# EAGLE design SensorBoard_Rev2 (EAGLE 4.16)
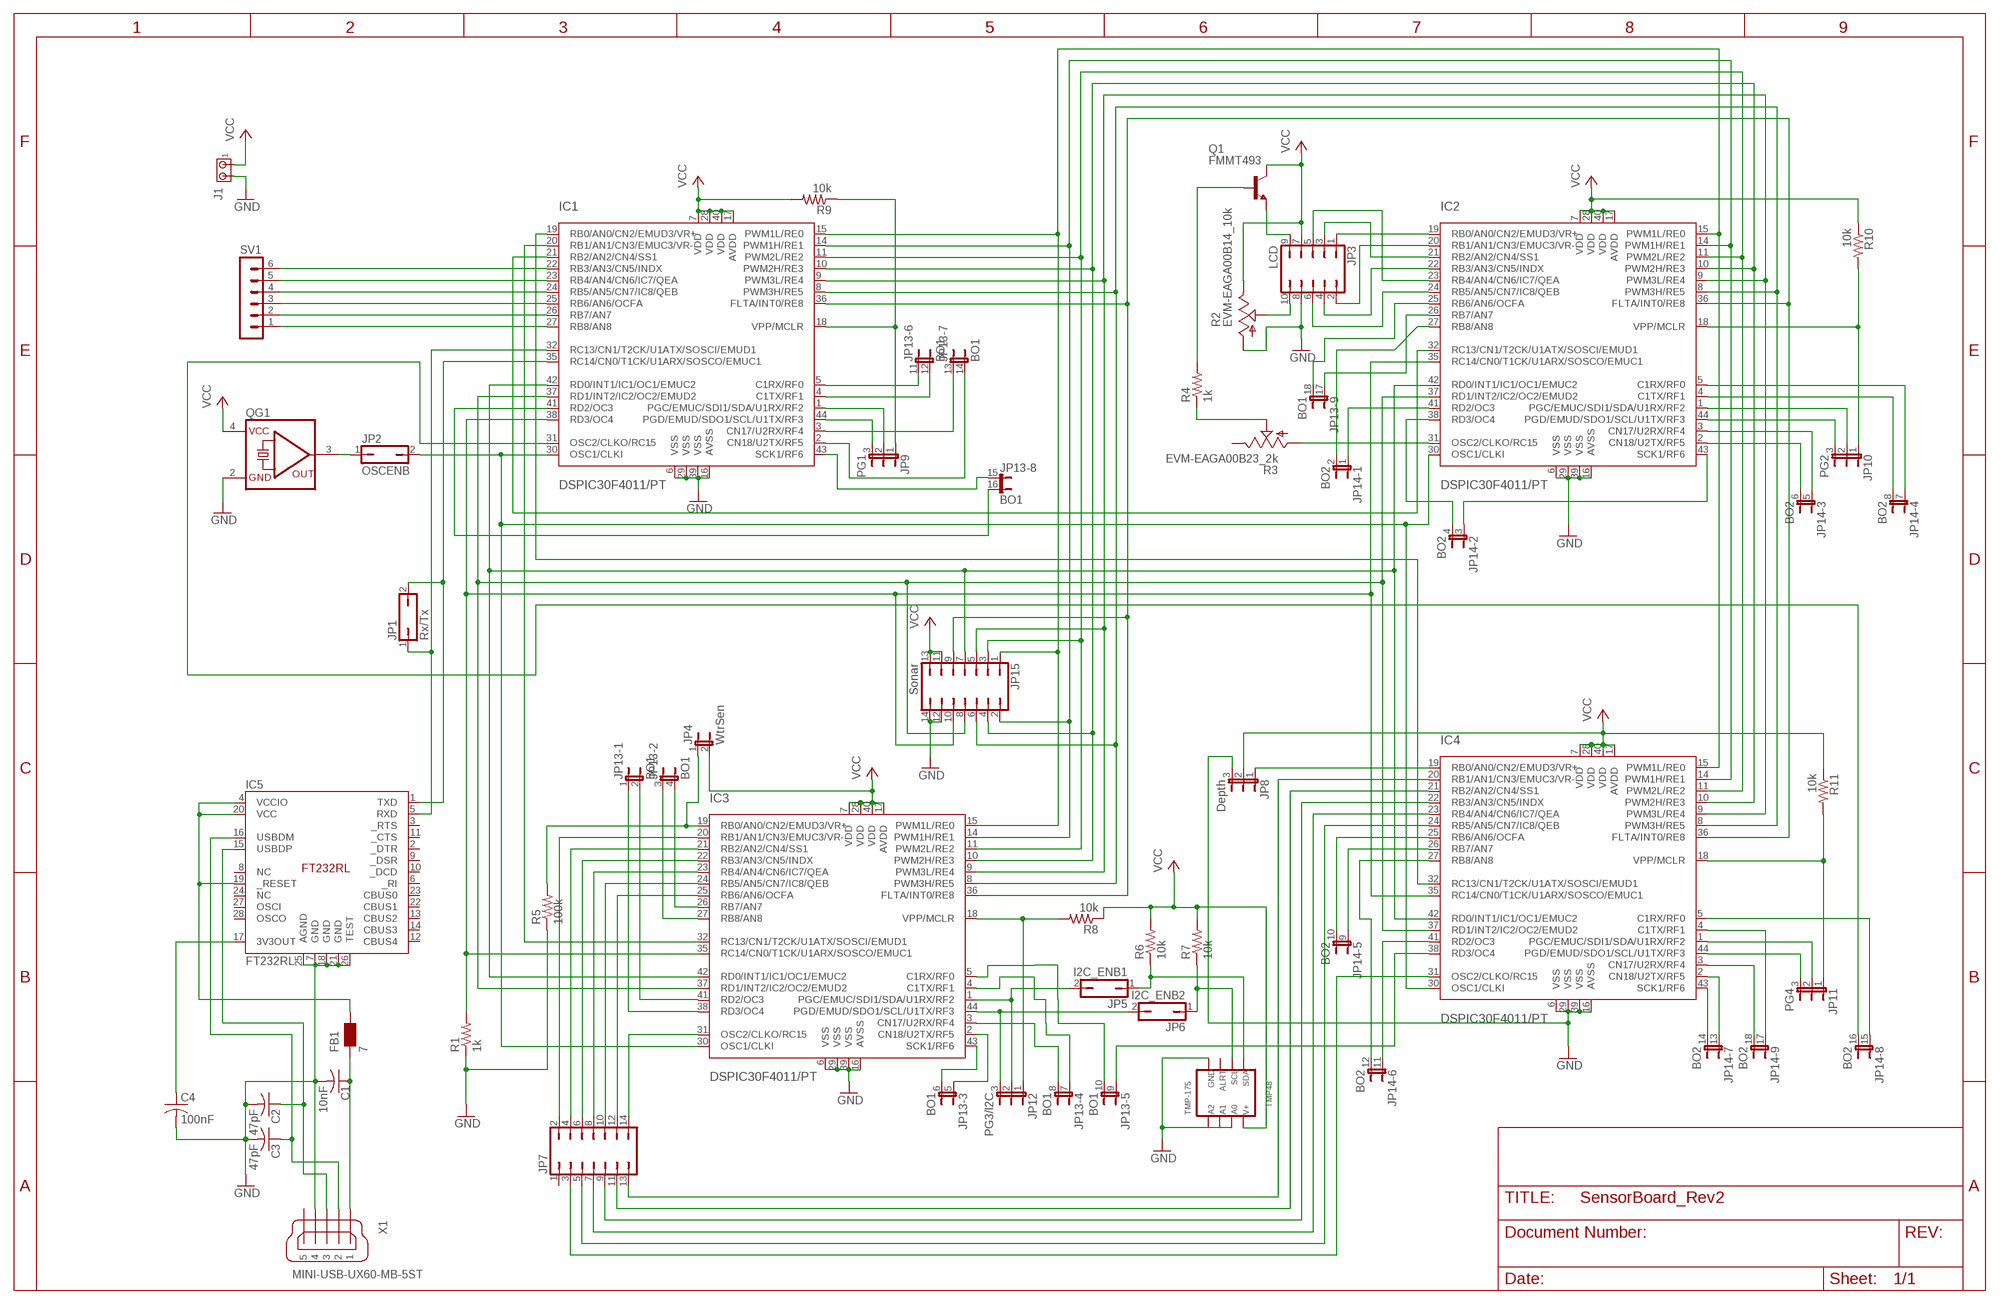
[diagram p0: schematic, sheet 1]

## Parts
C1  10nF  C-USC1206K  [C1206K]
C2  47pF  C-USC1206K  [C1206K]
C3  47pF  C-USC1206K  [C1206K]
C4  100nF  C-USC1206K  [C1206K]
FB1  7  WE-CBF_0805  [0805]
IC1  DSPIC30F4011/PT  [TQFP44]
IC2  DSPIC30F4011/PT  [TQFP44]
IC3  DSPIC30F4011/PT  [TQFP44]
IC4  DSPIC30F4011/PT  [TQFP44]
IC5  FT232RL  [SSOP-28]
J1  MTA02-156  [1X2MTA]
JP1  Rx/Tx  JP1Q  [JP1]
JP2  OSCENB  JP1Q  [JP1]
JP3  LCD  JP5Q  [JP5Q]
JP4  WtrSen  JP1E  [JP1]
JP5  I2C_ENB1  JP1Q  [JP1]
JP6  I2C_ENB2  JP1Q  [JP1]
JP7  JP7Q  [JP7Q]
JP8  Depth  JP2E  [JP2]
JP9  PG1  JP2E  [JP2]
JP10  PG2  JP2E  [JP2]
JP11  PG4  JP2E  [JP2]
JP12  PG3/I2C  JP2E  [JP2]
JP13  BO1  JP9QE  [JP9Q]
JP14  BO2  JP9QE  [JP9Q]
JP15  Sonar  JP7Q  [JP7Q]
Q1  FMMT493  -NPN-SOT23-EBC  [SOT23-EBC]
QG1  SG531  [DIL08-4]
R1  1k  R-US_R1206  [R1206]
R2  EVM-EAGA00B14_10k  TRIM_US-CT6  [CT6]
R3  EVM-EAGA00B23_2k  TRIM_US-CT6  [CT6]
R4  1k  R-US_R1206  [R1206]
R5  100k  R-US_R1206  [R1206]
R6  10k  R-US_R1206  [R1206]
R7  10k  R-US_R1206  [R1206]
R8  10k  R-US_R1206  [R1206]
R9  10k  R-US_R1206  [R1206]
R10  10k  R-US_R1206  [R1206]
R11  10k  R-US_R1206  [R1206]
SV1  MA06-1  [MA06-1]
TMP48  TMP-175  [SO-08]
X1  MINI-USB-UX60-MB-5ST  [UX60-MB-5ST]

## Nets
GND [4amps]: C1.2 C2.2 C3.2 C4.2 IC1.6(VSS) IC1.16(AVSS) IC1.29(VSS) IC1.39(VSS) IC2.6(VSS) IC2.16(AVSS) IC2.29(VSS) IC2.39(VSS) IC3.6(VSS) IC3.16(AVSS) IC3.29(VSS) IC3.39(VSS) IC4.6(VSS) IC4.16(AVSS) IC4.29(VSS) IC4.39(VSS) IC5.7(GND) IC5.18(GND) IC5.21(GND) IC5.25(AGND) IC5.26(TEST) J1.2 JP3.8 JP8.3 JP15.12 JP15.14 QG1.2(GND) R1.1 R2.A R5.1 TMP48.4 TMP48.5 TMP48.6 TMP48.7 X1.4
N$1: IC1.19(RB0/AN0/CN2/EMUD3/VR+) IC4.32(RC13/CN1/T2CK/U1ATX/SOSCI/EMUD1)
N$2: IC1.20(RB1/AN1/CN3/EMUC3/VR-) IC3.32(RC13/CN1/T2CK/U1ATX/SOSCI/EMUD1)
N$3: IC1.21(RB2/AN2/CN4/SS1) IC2.32(RC13/CN1/T2CK/U1ATX/SOSCI/EMUD1)
N$4: IC1.22(RB3/AN3/CN5/INDX) SV1.6
N$5: IC1.24(RB5/AN5/CN7/IC8/QEB) SV1.4
N$6: IC1.25(RB6/AN6/OCFA) SV1.3
N$7: IC1.26(RB7/AN7) SV1.2
N$8: IC1.27(RB8/AN8) SV1.1
N$9: IC1.30(OSC1/CLKI) IC2.30(OSC1/CLKI) IC3.30(OSC1/CLKI) IC4.30(OSC1/CLKI) JP2.2
N$10: C2.1 IC5.15(USBDP) X1.3
N$11: C1.1 FB1.1 X1.1
N$12: C3.1 IC5.16(USBDM) X1.2
N$13: C4.1 IC5.17(3V3OUT)
N$14: FB1.2 IC5.4(VCCIO) IC5.19(_RESET) IC5.20(VCC)
N$15: IC1.32(RC13/CN1/T2CK/U1ATX/SOSCI/EMUD1) IC5.5(RXD) JP1.1
N$16: IC1.35(RC14/CN0/T1CK/U1ARX/SOSCO/EMUC1) IC5.1(TXD) JP1.2
N$17: JP2.1 QG1.3(OUT)
N$18: IC1.23(RB4/AN4/CN6/IC7/QEA) SV1.5
N$19: IC1.15(PWM1L/RE0) IC2.15(PWM1L/RE0) IC3.15(PWM1L/RE0) IC4.15(PWM1L/RE0) JP15.1
N$20: IC1.14(PWM1H/RE1) IC2.14(PWM1H/RE1) IC3.14(PWM1H/RE1) IC4.14(PWM1H/RE1) JP15.2
N$21: IC1.11(PWM2L/RE2) IC2.11(PWM2L/RE2) IC3.11(PWM2L/RE2) IC4.11(PWM2L/RE2) JP15.3
N$22: IC1.10(PWM2H/RE3) IC2.10(PWM2H/RE3) IC3.10(PWM2H/RE3) IC4.10(PWM2H/RE3) JP15.4
N$23: IC1.9(PWM3L/RE4) IC2.9(PWM3L/RE4) IC3.9(PWM3L/RE4) IC4.9(PWM3L/RE4) JP15.5
N$24: IC1.8(PWM3H/RE5) IC2.8(PWM3H/RE5) IC3.8(PWM3H/RE5) IC4.8(PWM3H/RE5) JP15.6
N$25: IC1.42(RD0/INT1/IC1/OC1/EMUC2) IC2.42(RD0/INT1/IC1/OC1/EMUC2) IC3.42(RD0/INT1/IC1/OC1/EMUC2) IC4.42(RD0/INT1/IC1/OC1/EMUC2) JP15.7
N$26: IC1.37(RD1/INT2/IC2/OC2/EMUD2) IC2.37(RD1/INT2/IC2/OC2/EMUD2) IC3.37(RD1/INT2/IC2/OC2/EMUD2) IC4.37(RD1/INT2/IC2/OC2/EMUD2) JP15.8
N$27: IC1.38(RD3/OC4) IC2.35(RC14/CN0/T1CK/U1ARX/SOSCO/EMUC1) IC3.35(RC14/CN0/T1CK/U1ARX/SOSCO/EMUC1) IC4.35(RC14/CN0/T1CK/U1ARX/SOSCO/EMUC1) JP15.10 R1.2
N$28: IC1.36(FLTA/INT0/RE8) IC2.36(FLTA/INT0/RE8) IC3.36(FLTA/INT0/RE8) IC4.36(FLTA/INT0/RE8) JP15.9
N$29: IC2.19(RB0/AN0/CN2/EMUD3/VR+) JP3.1
N$30: IC2.20(RB1/AN1/CN3/EMUC3/VR-) JP3.2
N$31: IC2.21(RB2/AN2/CN4/SS1) JP3.3
N$32: IC2.22(RB3/AN3/CN5/INDX) JP3.4
N$33: IC2.23(RB4/AN4/CN6/IC7/QEA) JP3.5
N$34: IC2.24(RB5/AN5/CN7/IC8/QEB) JP3.6
N$35: JP3.10 R2.S
N$36: IC2.31(OSC2/CLKO/RC15) R3.A
N$37: R3.S R4.1
N$38: JP3.9 Q1.E
N$39: Q1.B R4.2
N$40: IC3.21(RB2/AN2/CN4/SS1) JP7.4
N$41: IC3.19(RB0/AN0/CN2/EMUD3/VR+) JP4.1 R5.2
N$42: IC3.22(RB3/AN3/CN5/INDX) JP7.6
N$43: JP6.1 R7.1 TMP48.2
N$44: JP5.1 R6.1 TMP48.1
N$45: IC3.1(PGC/EMUC/SDI1/SDA/U1RX/RF2) JP5.2 JP12.2
N$46: IC3.44(PGD/EMUD/SDO1/SCL/U1TX/RF3) JP6.2 JP12.3
N$47: IC3.23(RB4/AN4/CN6/IC7/QEA) JP7.8
N$48: IC3.24(RB5/AN5/CN7/IC8/QEB) JP7.10
N$49: IC3.25(RB6/AN6/OCFA) JP7.12
N$50: IC3.20(RB1/AN1/CN3/EMUC3/VR-) JP7.2
N$51: IC3.31(OSC2/CLKO/RC15) JP7.14
N$52: IC4.19(RB0/AN0/CN2/EMUD3/VR+) JP8.1
N$53: IC4.20(RB1/AN1/CN3/EMUC3/VR-) JP7.13
N$54: IC4.21(RB2/AN2/CN4/SS1) JP7.11
N$55: IC4.22(RB3/AN3/CN5/INDX) JP7.9
N$56: IC4.23(RB4/AN4/CN6/IC7/QEA) JP7.7
N$57: IC4.24(RB5/AN5/CN7/IC8/QEB) JP7.5
N$58: IC4.31(OSC2/CLKO/RC15) JP7.3
N$59: IC3.18(VPP/MCLR) JP12.1 R8.2
N$60: IC1.18(VPP/MCLR) JP9.1 R9.1
N$61: IC2.18(VPP/MCLR) JP10.1 R10.2
N$62: IC1.1(PGC/EMUC/SDI1/SDA/U1RX/RF2) JP9.2
N$63: IC1.44(PGD/EMUD/SDO1/SCL/U1TX/RF3) JP9.3
N$64: IC2.1(PGC/EMUC/SDI1/SDA/U1RX/RF2) JP10.2
N$65: IC2.44(PGD/EMUD/SDO1/SCL/U1TX/RF3) JP10.3
N$66: IC4.18(VPP/MCLR) JP11.1 R11.2
N$67: IC4.1(PGC/EMUC/SDI1/SDA/U1RX/RF2) JP11.2
N$68: IC4.44(PGD/EMUD/SDO1/SCL/U1TX/RF3) JP11.3
N$69: IC3.38(RD3/OC4) JP13.1
N$70: IC3.41(RD2/OC3) JP13.2
N$71: IC3.27(RB8/AN8) JP13.3
N$72: IC3.26(RB7/AN7) JP13.4
N$73: IC3.2(CN18/U2TX/RF5) JP13.5
N$74: IC3.43(SCK1/RF6) JP13.6
N$75: IC3.4(C1TX/RF1) JP13.7
N$76: IC3.3(CN17/U2RX/RF4) JP13.8
N$77: IC3.5(C1RX/RF0) JP13.10
N$78: IC1.43(SCK1/RF6) JP13.15
N$79: IC1.2(CN18/U2TX/RF5) JP13.14
N$80: IC1.3(CN17/U2RX/RF4) JP13.13
N$81: IC1.4(C1TX/RF1) JP13.12
N$82: IC1.5(C1RX/RF0) JP13.11
N$83: IC1.41(RD2/OC3) JP13.16
N$84: IC2.25(RB6/AN6/OCFA) JP13.18
N$85: IC2.26(RB7/AN7) JP13.17
N$86: IC2.27(RB8/AN8) JP14.2
N$87: IC2.41(RD2/OC3) JP14.1
N$88: IC2.38(RD3/OC4) JP14.4
N$89: IC2.43(SCK1/RF6) JP14.3
N$90: IC2.2(CN18/U2TX/RF5) JP14.6
N$91: IC2.3(CN17/U2RX/RF4) JP14.5
N$92: IC2.5(C1RX/RF0) JP14.7
N$93: IC2.4(C1TX/RF1) JP14.8
N$94: IC4.25(RB6/AN6/OCFA) JP14.10
N$95: IC4.26(RB7/AN7) JP14.9
N$96: IC4.27(RB8/AN8) JP14.12
N$97: IC4.41(RD2/OC3) JP14.11
N$98: IC4.43(SCK1/RF6) JP14.14
N$99: IC4.2(CN18/U2TX/RF5) JP14.13
N$100: IC4.3(CN17/U2RX/RF4) JP14.18
N$101: IC4.4(C1TX/RF1) JP14.17
N$102: IC4.5(C1RX/RF0) JP14.15
N$103: IC4.38(RD3/OC4) JP13.9
N$104: IC1.31(OSC2/CLKO/RC15) JP14.16
VCC [4amps]: IC1.7(VDD) IC1.17(AVDD) IC1.28(VDD) IC1.40(VDD) IC2.7(VDD) IC2.17(AVDD) IC2.28(VDD) IC2.40(VDD) IC3.7(VDD) IC3.17(AVDD) IC3.28(VDD) IC3.40(VDD) IC4.7(VDD) IC4.17(AVDD) IC4.28(VDD) IC4.40(VDD) J1.1 JP3.7 JP4.2 JP8.2 JP15.11 JP15.13 Q1.C QG1.4(VCC) R2.E R6.2 R7.2 R8.1 R9.2 R10.1 R11.1 TMP48.8
Unconnected: IC5.2(_DTR) IC5.3(_RTS) IC5.6(_RI) IC5.8(NC) IC5.9(_DSR) IC5.10(_DCD) IC5.11(_CTS) IC5.12(CBUS4) IC5.13(CBUS2) IC5.14(CBUS3) IC5.22(CBUS1) IC5.23(CBUS0) IC5.24(NC) IC5.27(OSCI) IC5.28(OSCO) JP7.1 R3.E TMP48.3 X1.5

## Library data of the parts
C1-C4 = rcl:C-US: CAPACITOR, American symbol
FB1 = wuerth-elektronik:WE-CBF: SMD EMI Suppression Ferrite Beads - excellent anti-EMI properties - low DCR - impedances till 3000 ohms - rated current up to 6 A
IC1-IC4 = microchip-dspic:DSPIC30F4011: dsPIC Motion Controller DSC
IC5 = ftdi4:FT232RL
J1 = con-amp:MTA02-156: AMP connector
JP1 JP2 JP5 JP6 = jumper:JP1Q: JUMPER
JP3 = jumper:JP5Q: JUMPER
JP4 = jumper:JP1E: JUMPER
JP7 JP15 = jumper:JP7Q: JUMPER
JP8-JP12 = jumper:JP2E: JUMPER
JP13 JP14 = jumper:JP9QE: JUMPER
Q1 = transistor:*-NPN-: NPN Transistror
QG1 = crystal:SG531: CRYSTAL RESONATOR
R1 R4-R11 = rcl:R-US_: RESISTOR, American symbol
R2 R3 = pot:TRIM_US-: POTENTIOMETER
SV1 = con-lstb:MA06-1: PIN HEADER
TMP48 = texas:TMP-175
X1 = con-hirose:MINI-USB-: MINI USB Connector Source: http://www.hirose.co.jp/cataloge_hp/e24000019.pdf

## Net classes
0 default: width 0.178 mm
1 2amps: width 0.178 mm
2 4amps: width 0.533 mm

## Board
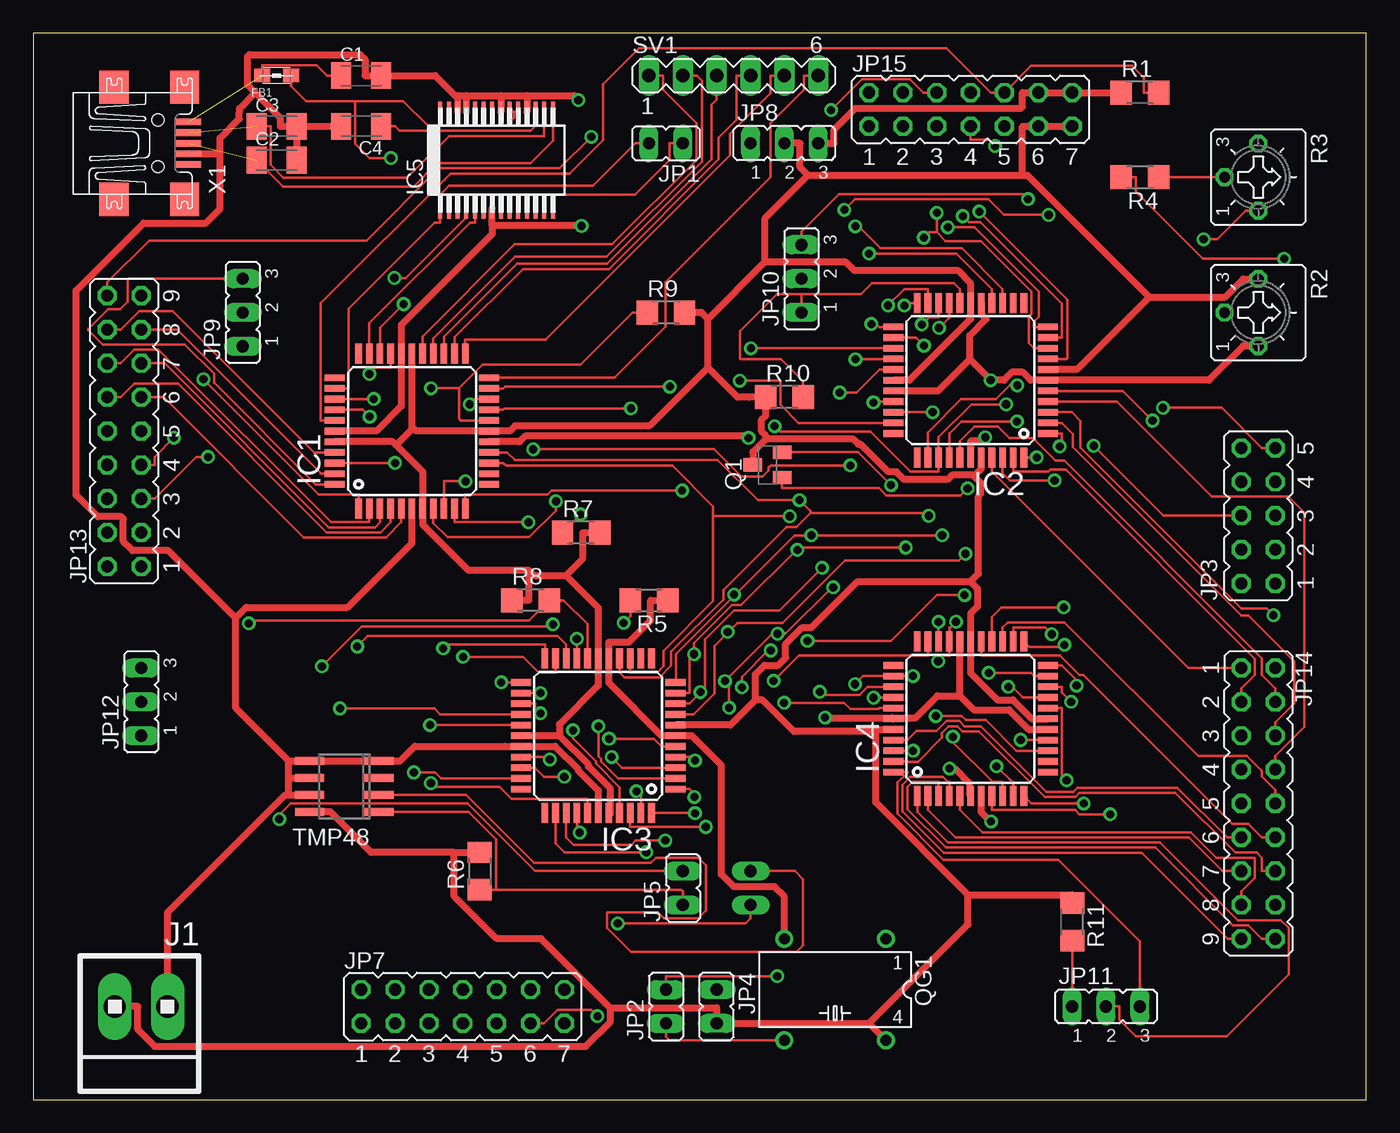
[diagram p1: board, top side]
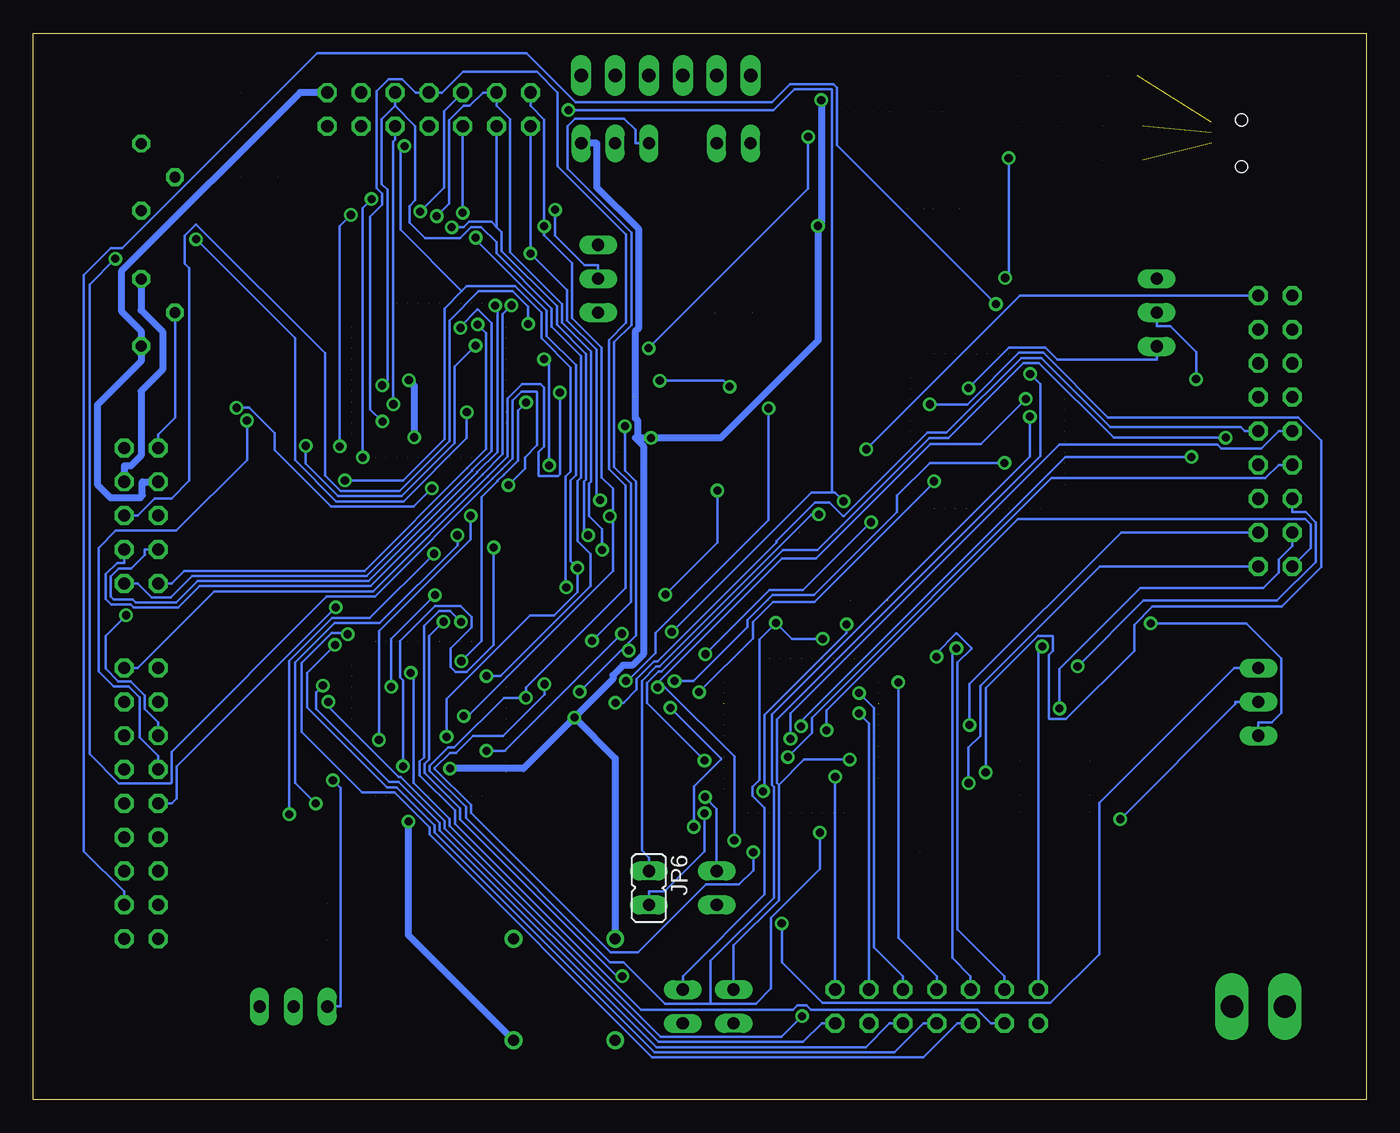
[diagram p2: board, bottom side, seen from below]

Size 100 x 80 mm. Coordinates in mm from the lower left corner, seen from the top.
Outline: 0,0 100,0 100,80 0,80 0,0
Copper layers (1*16): Top 0.035mm / dielectric 1.5mm / Bottom 0.035mm
Design rules "default": minimum track width 10mil, minimum drill 24mil, track to track 8mil, track to pad 8mil, pad to pad 8mil, via to via 8mil, smd to smd 8mil, copper to edge 40mil, drill to drill 8mil, minimum pad ring 10mil, minimum via ring 8mil, stop-mask expansion 4mil, vias tented up to drill 0mil, thermal gap 10mil

### Footprints (pad centres in the part's own frame; a part is rotated, then mirrored left to right if it is on the bottom)
C1206K = smd 1.5 x 2: 1 -1.5,0; 2 1.5,0
0805 = smd 1.2 x 1: 1 -1.1,0; 2 1.1,0
TQFP44 = smd 1.5 x 0.5: 1 -5.8,4; 2 -5.8,3.2; 3 -5.8,2.4; 4 -5.8,1.6; 5 -5.8,0.8; 6 -5.8,0; 7 -5.8,-0.8; 8 -5.8,-1.6; 9 -5.8,-2.4; 10 -5.8,-3.2; 11 -5.8,-4; 23 5.8,-4; 24 5.8,-3.2; 25 5.8,-2.4; 26 5.8,-1.6; 27 5.8,-0.8; 28 5.8,0; 29 5.8,0.8; 30 5.8,1.6; 31 5.8,2.4; 32 5.8,3.2; 33 5.8,4 | smd 0.5 x 1.5: 12 -4,-5.8; 13 -3.2,-5.8; 14 -2.4,-5.8; 15 -1.6,-5.8; 16 -0.8,-5.8; 17 0,-5.8; 18 0.8,-5.8; 19 1.6,-5.8; 20 2.4,-5.8; 21 3.2,-5.8; 22 4,-5.8; 34 4,5.8; 35 3.2,5.8; 36 2.4,5.8; 37 1.6,5.8; 38 0.8,5.8; 39 0,5.8; 40 -0.8,5.8; 41 -1.6,5.8; 42 -2.4,5.8; 43 -3.2,5.8; 44 -4,5.8
SSOP-28 = smd 0.3 x 1.5: 1 -4.225,-3.625; 2 -3.575,-3.625; 3 -2.925,-3.625; 4 -2.275,-3.625; 5 -1.625,-3.625; 6 -0.975,-3.625; 7 -0.325,-3.625; 8 0.325,-3.625; 9 0.975,-3.625; 10 1.625,-3.625; 11 2.275,-3.625; 12 2.925,-3.625; 13 3.575,-3.625; 14 4.225,-3.625; 15 4.225,3.625; 16 3.575,3.625; 17 2.925,3.625; 18 2.275,3.625; 19 1.625,3.625; 20 0.975,3.625; 21 0.325,3.625; 22 -0.325,3.625; 23 -0.975,3.625; 24 -1.625,3.625; 25 -2.275,3.625; 26 -2.925,3.625; 27 -3.575,3.625; 28 -4.225,3.625
1X2MTA = drill 1.676 long: 1 1.981,0; 2 -1.981,0
JP1 = drill 0.914 long: 1 0,-1.27; 2 0,1.27
JP5Q = drill 0.914 octagon: 1 -5.08,-1.27; 2 -5.08,1.27; 3 -2.54,-1.27; 4 -2.54,1.27; 5 0,-1.27; 6 0,1.27; 7 2.54,-1.27; 8 2.54,1.27; 9 5.08,-1.27; 10 5.08,1.27
JP7Q = drill 0.914 octagon: 1 -7.62,-1.27; 2 -7.62,1.27; 3 -5.08,-1.27; 4 -5.08,1.27; 5 -2.54,-1.27; 6 -2.54,1.27; 7 0,-1.27; 8 0,1.27; 9 2.54,-1.27; 10 2.54,1.27; 11 5.08,-1.27; 12 5.08,1.27; 13 7.62,-1.27; 14 7.62,1.27
JP2 = drill 0.914 long: 1 -2.54,0; 2 0,0; 3 2.54,0
JP9Q = drill 0.914 octagon: 1 -10.16,-1.27; 2 -10.16,1.27; 3 -7.62,-1.27; 4 -7.62,1.27; 5 -5.08,-1.27; 6 -5.08,1.27; 7 -2.54,-1.27; 8 -2.54,1.27; 9 0,-1.27; 10 0,1.27; 11 2.54,-1.27; 12 2.54,1.27; 13 5.08,-1.27; 14 5.08,1.27; 15 7.62,-1.27; 16 7.62,1.27; 17 10.16,-1.27; 18 10.16,1.27
SOT23-EBC = smd 1 x 1.4: B 0.95,-1.1; C 0,1.1; E -0.95,-1.1
DIL08-4 = drill 0.813 round: 1 -3.81,-3.81; 2 3.81,-3.81; 3 3.81,3.81; 4 -3.81,3.81
R1206 = smd 1.6 x 1.8: 1 -1.4,0; 2 1.4,0
CT6 = drill 0.813 octagon: A 2.515,0; E -2.515,0; S 0,-2.54
MA06-1 = drill 1.016 long: 1 -6.35,0; 2 -3.81,0; 3 -1.27,0; 4 1.27,0; 5 3.81,0; 6 6.35,0
SO-08 = smd 0.6 x 2.2: 1 -1.905,-2.6; 2 -0.635,-2.6; 3 0.635,-2.6; 4 1.905,-2.6; 5 1.905,2.6; 6 0.635,2.6; 7 -0.635,2.6; 8 -1.905,2.6
UX60-MB-5ST = smd 2 x 0.5: 1 2.25,1.6; 2 2.25,0.8; 3 2.25,0; 4 2.25,-0.8; 5 2.25,-1.6 | smd 2.2 x 2.5: M1 -3.3,-4.2; M2 -3.3,4.2; M3 2,4.2; M4 2,-4.2 | hole 0.9: 0,-1.75; 0,1.75

### Placement (x,y rotation side)
C1  24.6,76.83 0 top
C2  18.25,70.48 0 top
C3  18.25,73.02 0 top
C4  24.6,73.02 180 top
FB1  18.25,76.83 0 top
IC1  28.41,50.16 90 top
IC2  70.32,53.97 180 top
IC3  42.38,27.3 180 top
IC4  70.32,28.57 90 top
IC5  34.76,70.48 0 top
J1  8.09,6.98 180 top
JP1  47.46,71.75 90 top
JP2  47.46,6.98 0 top
JP3  91.91,43.81 90 top
JP4  51.27,6.98 180 top
JP5  48.73,15.87 0 top
JP6  53.81,15.87 180 bottom
JP7  32.22,6.98 0 top
JP8  56.35,71.75 0 top
JP9  15.71,59.05 90 top
JP10  57.62,61.59 90 top
JP11  80.48,6.98 0 top
JP12  8.09,29.84 90 top
JP13  6.82,50.16 90 top
JP14  91.91,22.22 270 top
JP15  70.32,74.29 0 top
Q1  55.08,47.62 90 top
QG1  60.16,8.25 180 top
R1  83.02,75.56 0 top
R2  91.91,59.05 270 top
R3  91.91,69.21 270 top
R4  83.02,69.21 180 top
R5  46.19,37.46 180 top
R6  33.49,17.14 90 top
R7  41.11,42.54 0 top
R8  37.3,37.46 0 top
R9  47.46,59.05 0 top
R10  56.35,52.7 0 top
R11  77.94,13.33 270 top
SV1  52.54,76.83 0 top
TMP48  23.33,23.49 90 top
X1  9.36,71.75 0 top

### Tracks (layer width: path | path; a pad name or v marks a point on that pad's centre or on a via)
GND  (via drill 0.61 pad 1.02)  (30 unrouted)
  Top 0.498: 70.22,23.74 70.22,22.87 IC4.6 | 64.44,28.65 64.44,28.57 | 71.47,58.54 71.47,58.56 71.16,58.87
  Top 0.533: 15.18,36.13 10.13,41.19 7.44,41.19 6.75,41.88 6.75,43.57 6.6,43.73 4.84,43.73 3.22,45.35 3.22,60.7 8.28,65.77 12.93,65.77 14,66.83 14,70.96 | 14,70.96 14,72.14 15.45,73.59 15.45,74.1 15.47,74.11 15.47,74.35 16.66,75.55 | 16.66,75.55 18.53,73.68 18.53,73.02 C3.2 | 16.66,75.55 16.07,76.13 16.07,78.25 16.23,78.41 24.53,78.41 24.88,78.05 24.88,76.83 C1.2 30.14,76.83 31.83,75.14 | 15.18,36.13 15.18,29.37 19.16,25.39 | IC1.6 28.41,41.76 23.58,36.92 15.97,36.92 15.18,36.13 | IC3.39 42.38,23.2 40.9,24.67 40.9,24.75 39.15,26.5 IC3.29 35.36,26.5 28.61,26.5 27.5,25.39 TMP48.4 TMP48.5 19.16,25.39 | 69.52,30.28 67.83,30.28 66.19,28.65 64.44,28.65 59.42,28.65 v59.4,28.66 | QG1.2 56.35,15.23 55.62,15.96 52.55,15.96 51.63,16.88 51.63,25.07 49.4,27.3 IC3.6 47.14,27.3 43.18,31.26 IC3.16 43.18,34.32 44.68,34.32 46.32,35.96 46.32,37.46 R5.1 | 69.52,30.28 70.56,29.25 73.19,29.25 74.67,27.77 IC4.16 | v71.42,49.69 71.13,49.39 70.32,49.39 IC2.39 | 37.04,75.33 40.55,75.33 v40.88,74.99 | 70.22,23.74 69.13,24.83 v68.74,24.83 | 69.52,30.28 IC4.29 | v53.66,49.64 53.53,49.77 36.91,49.77 36.49,49.36 IC1.16 | 34.44,65.55 34.44,64.95 27.61,58.12 IC1.29 27.61,52.03 25.74,50.16 23.83,50.16 IC1.39 | 35.09,75.33 37.04,75.33 | v41.13,65.55 34.44,65.55 | 34.44,65.55 34.44,65.63 IC5.7 | 70.25,55.55 67.88,53.17 IC2.29 | 70.25,55.55 v71.83,53.97 72.82,53.97 73.42,54.57 74.23,54.57 74.83,53.97 IC2.6 88.21,53.97 90.78,56.54 R2.A | 19.16,22.86 18.88,22.86 10.07,14.04 J1.2 | 70.25,55.55 70.25,57.33 71.47,58.54 | C3.2 C2.2 | C3.2 C4.2 | IC2.16 71.16,59.73 71.16,58.87 | 19.16,22.86 19.16,24.12 | 19.16,24.12 19.16,25.39
  Top 0.533: 31.83,75.14 31.83,75.33 32.48,75.33 | 31.83,75.14 IC5.26 | 37.04,75.33 IC5.18 | 35.09,75.33 35.09,75.14 IC5.21 | 32.48,75.33 35.09,75.33 | 32.48,75.33 32.48,75.14 IC5.25 | JP8.3 60.07,71.75 60.07,72.78 61.67,74.38 74.06,74.38 74.22,74.53 74.22,75.56 JP15.12 JP15.14 R1.1 | 19.16,22.86 TMP48.7 | 19.16,24.12 TMP48.6 | 14,70.96 13.98,70.96 13.98,70.95 X1.4 | 64.44,28.57 IC4.39 64.44,28.57
  Bottom 0.533: JP15.14 79.99,75.56 93.4,62.14 93.4,59.16 91.91,57.67 R2.A 91.91,55.4 95.2,52.11 95.2,46.15 94.22,45.17 91.98,45.17 91.82,45.32 91.82,46.35 JP3.8 | v59.4,28.66 56.52,31.55 56.52,31.83 55.77,32.58 55.06,32.58 54.22,33.41 54.22,49.04 54.82,49.64 | 54.82,49.64 54.63,49.83 54.63,50.93 54.82,51.12 54.82,57.64 54.57,57.89 54.57,65.29 57.71,68.42 57.71,71.75 JP8.3 | v59.4,28.66 63.23,24.83 v68.74,24.83 | v71.83,53.97 71.42,53.56 v71.42,49.69 | v40.88,74.99 40.88,65.8 v41.13,65.55 41.13,56.95 48.44,49.64 v53.66,49.64 54.82,49.64 | QG1.2 56.35,25.61 v59.4,28.66
N$1  (via drill 0.61 pad 1.02)  (2 unrouted)
  Top 0.178: v55.53,31.42 57.44,33.33 67.12,33.33 IC4.32 | IC1.19 35.25,51.76 35.35,51.86 v44.84,51.86
  Bottom 0.178: v55.53,31.42 55.42,31.42 53.32,33.52 53.32,35 44.84,43.48 v44.84,51.86
N$2  (via drill 0.61 pad 1.02)  (2 unrouted)
  Top 0.178: IC3.32 30.61,24.1 30.16,24.54 v28.55,24.54 | v32.73,52.16 33.13,52.56 IC1.20
  Bottom 0.178: v32.73,52.16 29.91,52.16 26.04,56.03 24.23,56.03 19.36,51.17 5.08,51.17 3.37,49.46 3.37,39.94 6.32,37 16.04,37 17.41,35.62 17.41,33.65 22.52,28.54 23.77,28.54 23.81,28.59 23.81,33.35 23.5,33.66 23.5,34.75 23.55,34.8 24.64,34.8 28.55,30.89 v28.55,24.54
N$3  (via drill 0.61 pad 1.02)  (2 unrouted)
  Top 0.178: v47.76,53.49 35.38,53.49 35.25,53.36 IC1.21 | v53,53.93 56.01,53.93 56.05,53.88 56.05,52.14 57.42,50.77 IC2.32
  Bottom 0.178: v53,53.93 48.2,53.93 v47.76,53.49
N$4  (1 unrouted)
  Top 0.178: IC1.22 43.62,54.16 47.44,57.98 47.44,61.34 55.32,69.21 55.32,73.26 57.83,75.77 57.83,76.83 SV1.6
N$5  (1 unrouted)
  Top 0.178: IC1.24 31.61,57.2 36.74,62.32 43.2,62.32 51.42,70.54 51.42,72.17 52.75,73.5 52.75,76.83 SV1.4
N$6  (1 unrouted)
  Top 0.178: SV1.3 51.27,75.01 50.9,74.64 50.9,70.56 43.04,62.71 36.28,62.71 30.81,57.24 IC1.25
N$7  (1 unrouted)
  Top 0.178: SV1.2 49.79,76.83 50.17,76.44 50.17,70.38 43.02,63.23 36.13,63.23 30.01,57.1 IC1.26
N$8  (1 unrouted)
  Top 0.178: SV1.1 47.25,76.83 47.25,75.77 49.75,73.27 49.75,70.49 43.42,64.17 36.12,64.17 29.21,57.26 IC1.27
N$9  (via drill 0.61 pad 1.02)  (4 unrouted)
  Top 0.178: v63.03,52.3 63.1,52.37 63.48,52.37 IC2.30 | v25.21,54.45 25.68,54.91 26.81,54.91 IC1.30 | v55.81,9.26 47.46,9.26 JP2.2 | v69.23,35.85 68.79,35.41 68.72,35.41 IC4.30 68.72,33.33 68.33,33.33 v67.89,32.89 | v38.74,25.52 38.56,25.7 37.62,25.7 IC3.30
  Bottom 0.178: 44.06,23.62 44.06,14.95 47.46,11.55 47.46,9.26 JP2.2 | v25.21,54.45 24.43,53.66 24.43,48.29 44.19,28.52 44.19,23.75 44.06,23.62 | v38.74,25.52 42.16,25.52 44.06,23.62 | v67.89,32.89 66.38,34.4 66.38,45.2 65.15,46.42 65.15,46.44 64.68,46.91 64.67,46.91 63.64,47.93 63.64,51.69 v63.03,52.3 | v55.81,9.26 56.22,9.26 67.99,21.02 67.99,21.84 70.64,24.5 70.64,25.2 70.3,25.54 70.3,34.78 v69.23,35.85
N$10  (3 unrouted)
  Top 0.178: IC5.15 38.98,71.94 37.3,70.25 30.26,70.25 28.51,68.5 18.72,68.5 C2.1
N$11  (3 unrouted)
  Top 0.178: C1.1 22.05,76.83 21.26,77.62 17.15,77.62 FB1.1
N$12  (3 unrouted)
  Top 0.178: C3.1 17.79,73.02 17.79,70.13 18.75,69.17 28.06,69.17 31.18,72.29 38.33,72.29 38.33,72.3 IC5.16
N$13  (2 unrouted)
  Top 0.178: C4.1 27.14,73.02 27.49,72.68 37.3,72.68 37.69,73.06 IC5.17
N$14  (via drill 0.61 pad 1.02)  (4 unrouted)
  Top 0.178: 24.14,74.92 20.46,74.92 19.35,76.03 FB1.2 | 24.14,74.92 27.76,74.92 29.63,73.06 35.45,73.06 36.06,73.67 36.06,74.1 | 24.14,74.92 24.14,71.72 25.23,70.64 v26.82,70.64 | v27.08,61.65 27.95,61.65 32.48,66.19 IC5.4 | 36.06,74.1 IC5.19 | 36.06,74.1 IC5.20
  Bottom 0.178: v26.82,70.64 26.82,61.91 v27.08,61.65
N$15  (2 unrouted)
  Top 0.178: IC1.32 25.21,58.24 32.78,65.81 33.13,65.81 IC5.5 33.13,67.9 45.14,67.9 47.72,70.48 47.72,71.75 JP1.1
N$16  (2 unrouted)
  Top 0.178: JP1.2 45.18,71.75 41.99,68.56 31.19,68.56 30.54,67.9 IC5.1 30.54,65.81 30.12,65.81 23.65,59.35 23.65,53.36 IC1.35
N$17
  Top 0.178: JP2.1 47.46,4.7 47.72,4.44 QG1.3
N$18  (1 unrouted)
  Top 0.178: IC1.23 32.41,57 38.42,57 52.28,70.86 52.28,72.49 55.29,75.5 55.29,76.83 SV1.5
N$19  (via drill 0.61 pad 1.02)  (4 unrouted)
  Top 0.178: 58.3,44 66.98,44 v67.18,43.8 | 58.3,44 58.3,44.16 v57.48,44.98 54.36,44.98 51.34,47.99 36.13,47.99 35.55,48.56 IC1.15 | 58.3,44 57.27,42.96 56.51,42.96 51.77,38.22 51.77,37.53 47.85,33.6 47.85,32.55 46.97,31.67 44.36,31.67 43.98,32.05 IC3.15 | IC4.15 74.09,26.97 v74.07,26.98 | v62.7,63.48 69.25,63.48 71.92,60.81 IC2.15
  Bottom 0.178: v74.07,26.98 74.07,35.14 67.18,42.03 v67.18,43.8 | v57.48,44.98 57.76,45.25 57.76,56.26 59.96,58.46 59.96,60.74 v62.7,63.48 62.7,72.01 JP15.1
N$20  (via drill 0.61 pad 1.02)  (4 unrouted)
  Top 0.178: v67.71,28.78 69.64,28.78 69.95,28.47 71.45,28.47 73.75,26.17 75.08,26.17 IC4.14 | 50.99,43.76 v56.75,43.76 | 50.99,43.76 50.99,44.51 47.95,47.55 35.46,47.55 35.25,47.76 IC1.14 | v61.67,65.53 61.9,65.53 63.56,63.87 69.67,63.87 72.72,60.81 IC2.14 | IC3.14 44.78,32.05 46.81,32.05 47.27,32.52 47.27,33.67 50.99,37.39 50.99,43.76
  Bottom 0.178: v67.71,28.78 67.38,28.78 56.51,39.65 56.51,43.53 v56.75,43.76 56.51,44 56.51,45.83 57.36,46.68 57.36,56.4 59.57,58.61 59.57,62.75 61.67,64.85 v61.67,65.53 61.67,73.52 62.7,74.55 JP15.2
N$21  (via drill 0.61 pad 1.02)  (4 unrouted)
  Top 0.178: v48.68,45.69 38.88,45.69 38.59,45.41 32.41,45.41 IC1.11 | v68.19,42.34 v58.37,42.34 57.12,42.34 52.68,37.89 | v78.82,22.21 74.88,22.21 IC4.11 | v68.61,65.44 70.62,65.44 75.46,60.6 75.46,58.76 75.08,58.38 75.08,57.97 IC2.11 | IC3.11 48.23,31.36 48.23,33.45 52.68,37.89 | v52.58,37.89 52.68,37.89
  Bottom 0.178: 65.24,65.47 64.86,65.08 64.86,63.65 60.72,59.52 60.72,58.14 58.53,55.94 58.53,46.53 58.68,46.37 58.68,42.65 v58.37,42.34 | v52.58,37.89 48.68,41.79 v48.68,45.69 | v78.82,22.21 80.35,23.74 80.35,32.8 77.41,35.74 74.01,35.74 68.19,41.57 v68.19,42.34 | v68.61,65.44 67.71,65.44 67.3,65.85 65.63,65.85 65.24,65.47 | 65.24,65.47 65.24,72.01 JP15.3
N$22  (via drill 0.61 pad 1.02)  (4 unrouted)
  Top 0.178: v72.26,25.01 73.45,23.81 73.52,23.81 IC4.10 | 57.25,41.23 v57.32,41.23 | 57.25,41.23 57.43,41.42 v65.46,41.42 | 57.25,41.23 53.1,37.09 52.42,37.09 49.57,34.24 v49.57,33.41 49.22,33.06 49.22,30.5 IC3.10 | v69.74,66.28 70.19,65.83 71.04,65.83 77.16,59.7 77.16,57.17 IC2.10 | v37.15,43.32 31.61,43.32 IC1.10
  Bottom 0.178: v57.32,41.23 57.32,42.81 58.3,43.8 58.3,46.21 58.14,46.37 58.14,56.1 60.34,58.3 60.34,59.68 64.23,63.57 64.23,73.55 65.24,74.55 JP15.4 66.25,75.56 67.25,74.55 67.72,74.55 68.79,73.49 68.79,67.23 v69.74,66.28 | v49.57,33.41 44.76,38.22 42.24,38.22 v37.15,43.32 | v65.46,41.42 65.46,34.12 67.5,32.08 68.3,32.08 68.69,32.47 68.69,33.85 67.11,35.43 67.11,36.2 67.96,37.05 69.86,37.05 72.49,34.42 72.49,31.68 72.26,31.46 v72.26,25.01
N$23  (via drill 0.61 pad 1.02)  (4 unrouted)
  Top 0.178: v68.99,27.21 68.99,26.8 71.98,23.81 72.72,23.81 IC4.9 | IC1.9 30.81,46.38 30.82,46.39 v32.42,46.39 | 67.78,65.08 v67.78,66.53 | v59.17,39.89 55.99,36.71 52.58,36.71 50.38,34.51 50.38,30.9 v50.05,30.57 50.05,30.53 49.22,29.7 IC3.9 | 67.78,65.08 67.22,65.08 v66.81,64.67 | 67.78,65.08 68.44,64.42 71.11,64.42 74.88,60.64 74.88,58.92 74.69,58.72 74.69,56.76 75.08,56.37 IC2.9
  Bottom 0.178: v66.81,64.67 66.81,64.52 61.49,59.21 61.49,57.29 59.29,55.09 59.29,46.84 59.68,46.46 59.68,40.4 v59.17,39.89 59.17,38.09 60.94,36.32 62.72,36.32 68.99,30.05 v68.99,27.21 | v50.05,30.57 46.02,34.6 46.02,35.83 44.52,37.33 41.38,37.33 32.42,46.29 v32.42,46.39 | v67.78,66.53 67.78,72.01 JP15.5
N$24  (via drill 0.61 pad 1.02)  (4 unrouted)
  Top 0.178: 52,34.93 52.1,35.03 v52.1,35.09 | 52,34.93 52.82,35.76 56.21,35.76 60.9,40.45 69.44,40.45 v69.94,40.95 | IC3.8 49.52,28.9 51.09,30.46 51.09,34.02 52,34.93 | IC1.8 30.01,43.24 31.06,42.19 37.21,42.19 39.21,44.2 v39.21,44.89 | JP15.6 66.77,75.56 65.77,76.57 62.17,76.57 v59.85,74.24 | v80.8,21.41 78.49,21.41 78.17,21.73 71.92,21.73 IC4.8 | v70.97,66.63 77.57,60.04 77.57,55.62 77.52,55.57 IC2.8
  Bottom 0.178: 40.08,45.55 41.63,45.55 v52.1,35.09 | 40.08,45.55 39.87,45.55 v39.21,44.89 | v59.85,74.24 44.45,74.24 42.9,75.8 40.13,75.8 40.08,75.75 40.08,45.55 | v69.94,40.95 74.77,36.12 77.57,36.12 80.8,32.9 v80.8,21.41 | JP15.6 69.19,74.15 69.19,68.41 v70.97,66.63
N$25  (via drill 0.61 pad 1.02)  (4 unrouted)
  Top 0.178: v50.45,20.46 44.78,20.46 IC3.42 | v52.2,29.39 52.2,31.08 v51.89,31.39 55.45,34.95 v55.84,34.95 56.44,34.95 59.91,38.42 v60.01,38.42 | v76.63,46.45 73.28,46.45 72.72,47.02 IC2.42 | v27.14,47.76 IC1.42 | v66,26.17 IC4.42 | v72.16,71.53 71.68,72.01 70.32,72.01 JP15.7
  Bottom 0.178: v52.2,29.39 48.4,25.58 48.4,25.54 50.45,23.48 v50.45,20.46 | v76.63,46.45 72.26,46.45 69.16,49.56 69.16,59.36 67.86,60.66 | v51.89,31.39 50.46,31.39 46.41,35.45 46.41,35.99 44.55,37.84 41.41,37.84 35.19,44.07 35.19,45.3 32.73,47.76 v27.14,47.76 | 67.86,60.66 67.47,61.04 63.87,61.04 61.87,59.05 61.87,57.13 59.68,54.93 59.68,47.11 60.06,46.73 60.06,38.47 v60.01,38.42 | 67.86,60.66 72.46,65.26 72.46,71.23 v72.16,71.53 | v55.84,34.95 64.62,26.17 v66,26.17
N$26  (via drill 0.61 pad 1.02)  (4 unrouted)
  Top 0.178: v25.23,51.24 24.71,51.76 IC1.37 | v73.8,50.88 69.64,50.88 68.72,49.96 IC2.37 | v40.99,20.02 40.99,20.25 40.78,20.46 IC3.37 | v63.04,30.15 63.45,30.15 63.48,30.17 IC4.37
  Bottom 0.178: v25.23,51.24 25.23,48.24 44.58,28.89 44.58,23.59 44.45,23.46 44.45,15.13 49.19,10.39 49.19,7.2 | 49.19,7.2 52.62,7.2 55.72,10.3 56.72,10.3 67.54,21.12 67.54,21.94 70.26,24.66 70.26,25.04 68.89,26.4 68.44,26.4 64.69,30.15 v63.04,30.15 63.04,30.91 55.55,38.4 55.55,46.05 56.8,47.3 56.8,56.99 55.52,58.28 55.52,64.9 60.65,70.04 60.65,75.55 62.21,77.11 67.77,77.11 69.31,75.56 JP15.8 71.33,75.56 72.33,76.57 73.33,76.57 74.25,75.64 74.25,68.4 73.82,67.96 73.82,67.14 74.71,66.25 74.71,51.79 v73.8,50.88 | v40.99,20.02 40.99,17.29 44.65,13.63 44.65,8.34 45.79,7.2 49.19,7.2
N$27  (via drill 0.61 pad 1.02)  (5 unrouted)
  Top 0.178: IC3.35 39.18,19.21 39.84,18.55 v45.99,18.55 | v61.65,31.17 62.25,31.77 IC4.35 v66,31.77 | IC1.38 21.57,50.96 21.57,59.75 31.31,69.49 40.25,69.49 42.73,71.97 42.73,76.19 45.43,78.89 68.52,78.89 71.85,75.56 JP15.10 74.85,77.55 82.43,77.55 83.33,76.66 83.33,75.56 R1.2 | v73.82,53.59 73.26,53.59 72.22,52.55 69.61,52.55 67.12,50.06 IC2.35
  Bottom 0.178: 72.86,74.55 71.35,73.05 71.35,67.47 71.78,67.04 71.78,65.8 70.61,64.62 67.99,64.62 67.14,65.47 66.39,65.47 65.24,64.32 65.24,63.5 61.11,59.36 61.11,57.98 58.91,55.79 58.91,46.69 59.17,46.42 59.17,41.92 58.18,40.93 58.18,38.55 64.95,31.77 v66,31.77 | v61.65,31.17 61.65,30.4 64.75,27.3 67,27.3 68.28,26.02 68.74,26.02 69.88,24.88 69.88,24.82 67.15,22.09 67.15,21.51 56.68,11.03 54.64,11.03 49.53,16.13 47.06,16.13 45.99,17.2 v45.99,18.55 | 72.86,74.55 73.87,73.55 73.87,68.69 73.44,68.26 73.44,53.97 v73.82,53.59 | 72.86,74.55 JP15.10 72.86,74.55
N$28  (via drill 0.61 pad 1.02)  (4 unrouted)
  Top 0.178: IC3.36 39.98,19.66 40.51,19.12 44.87,19.12 45.19,19.44 v47.41,19.44 | v53.16,30.92 53.16,31.72 55.13,33.69 v55.33,33.69 | v59.01,30.59 59.24,30.36 61.98,30.36 62.59,30.97 IC4.36 | v25.54,52.56 IC1.36 | v72.99,52.16 70.37,52.16 67.92,49.71 IC2.36 67.92,47.13 65.8,47.13 62.81,50.11 56.03,50.11 v55.61,50.53
  Bottom 0.178: v47.41,19.44 47.41,25.72 52.61,30.92 v53.16,30.92 53.16,31.26 43.84,40.58 41.27,40.58 32.68,49.18 28.92,49.18 v25.54,52.56 | 55.33,34.28 55.33,34.27 v55.33,33.69 | 55.33,34.28 v59.01,30.59 | v72.99,52.16 72.99,71.88 72.86,72.01 JP15.9 | v55.61,50.53 55.61,47.2 54.78,46.37 54.78,34.82 55.33,34.28
N$29  (via drill 0.61 pad 1.02)  (1 unrouted)
  Top 0.178: IC2.19 68.72,58.66 v67.95,57.9
  Bottom 0.178: v67.95,57.9 67.95,58 66.69,59.26 66.62,59.26 65.63,58.26 65.63,48.67 67.07,47.22 67.07,47.21 74.99,39.29 88.09,39.29 89.7,37.68 91.12,37.68 92.17,38.73 JP3.1
N$30  (via drill 0.61 pad 1.02)  (1 unrouted)
  Top 0.178: v66.66,58.15 67.23,58.73 67.92,58.73 IC2.20
  Bottom 0.178: v66.66,58.15 66.02,57.51 66.02,48.82 67.45,47.38 67.45,47.37 75.15,39.67 88.69,39.67 89.63,38.73 JP3.2
N$31  (via drill 0.61 pad 1.02)  (1 unrouted)
  Top 0.178: v64.13,59.59 65.35,60.81 67.12,60.81 IC2.21
  Bottom 0.178: v64.13,59.59 64.8,58.93 64.8,48.42 66.3,46.91 66.3,46.89 74.68,38.52 87.52,38.52 89.13,36.91 92.48,36.91 92.71,37.14 94.14,37.14 94.57,37.57 94.57,39.42 93.72,40.26 93.18,40.26 JP3.3
N$32  (via drill 0.61 pad 1.02)  (1 unrouted)
  Top 0.178: IC2.22 65.55,59.77 v65.35,59.58
  Bottom 0.178: v65.35,59.58 65.18,59.4 65.18,48.58 66.69,47.07 66.69,47.05 74.84,38.9 87.68,38.9 89.28,37.3 92.32,37.3 92.55,37.52 93.98,37.52 94.19,37.73 94.19,39.26 93.6,39.84 92.65,39.84 91.65,40.85 91.65,41.27 JP3.4
N$33  (via drill 0.61 pad 1.02)  (1 unrouted)
  Top 0.178: IC2.23 63.48,57.97 63.26,58.19 v62.87,58.19
  Bottom 0.178: v62.87,58.19 62.87,59.49 64.03,60.66 66.58,60.66 68.78,58.46 68.78,49.4 72.53,45.65 76.96,45.65 78.11,46.8 78.11,56.01 87.77,65.66 87.83,65.66 88.66,64.83 88.66,62.73 88.29,62.37 88.29,46.44 89.63,45.1 90.89,45.1 92.17,43.81 JP3.5
N$34  (via drill 0.61 pad 1.02)  (1 unrouted)
  Top 0.178: JP3.6 84.8,43.81 v79.56,49.05 | v66.82,56.57 66.22,57.17 IC2.24
  Bottom 0.178: v79.56,49.05 v79.55,49.05 79.55,47.7 77.12,45.27 72.37,45.27 68.39,49.25 68.39,55 v66.82,56.57
N$35
  Bottom 0.178: JP3.10 90.64,49.9 89.37,51.17 R2.S
N$36  (via drill 0.61 pad 1.02)  (1 unrouted)
  Top 0.178: v67.48,51.57 65.56,51.57 IC2.31 | R3.A 90.95,66.69 88.81,64.55 v87.8,64.55
  Bottom 0.178: v87.8,64.55 80.36,57.12 80.36,47.97 77.28,44.88 72.21,44.88 67.48,49.62 v67.48,51.57
N$37  (1 unrouted)
  Top 0.178: R4.1 R3.S
N$38  (via drill 0.61 pad 1.02)  (1 unrouted)
  Top 0.178: v70.1,45.86 69.55,45.3 64.02,45.3 63.45,45.88 56.18,45.88 Q1.E | v84.75,51.9 89.16,51.9 92.17,48.89 JP3.9
  Bottom 0.178: v84.75,51.9 83.79,51.9 81.88,50 81.88,48.73 77.65,44.5 71.46,44.5 v70.1,45.86
N$39  (via drill 0.61 pad 1.02)  (2 unrouted)
  Top 0.178: R4.2 82.72,69.21 82.72,68.11 87.74,63.09 v93.84,63.09 | v64.35,46.1 61.88,48.57 Q1.B
  Bottom 0.178: v93.84,63.09 95.78,61.16 95.78,25.93 93.58,23.73 89.68,23.73 89.63,23.78 89.63,26.1 77.98,37.75 74.36,37.75 65.54,46.58 65.54,46.59 64.84,47.29 64.83,47.29 64.03,48.09 64.03,52.44 63.36,53.11 62.26,53.11 62.21,53.06 62.21,49.1 63.12,48.18 63.12,47.33 v64.35,46.1
N$40  (via drill 0.61 pad 1.02)  (1 unrouted)
  Top 0.178: v32.24,33.22 36.74,33.22 37.9,32.05 39.18,32.05 IC3.21
  Bottom 0.178: v32.24,33.22 32.24,33.49 30.77,34.96 30.7,34.96 29.62,33.88 29.62,33.82 30.66,32.78 30.66,12.78 27.14,9.26 JP7.4
N$41  (via drill 0.61 pad 1.02)  (2 unrouted)
  Top 0.178: v44.29,35.76 44.79,36.27 R5.2 | IC3.19 v40.78,34.56
  Bottom 0.178: v40.78,34.56 43.09,34.56 v44.29,35.76 45.53,34.52 45.53,23.98 45.54,23.98 46.05,23.46 46.05,22.8 45.15,21.89 45.15,15.38 51.27,9.26 JP4.1
N$42  (via drill 0.61 pad 1.02)  (1 unrouted)
  Top 0.178: v30.74,33.85 31.04,34.14 38.38,34.14 IC3.22
  Bottom 0.178: v30.74,33.85 31.04,33.55 31.04,10.62 29.68,9.26 JP7.6
N$43  (via drill 0.61 pad 1.02)  (2 unrouted)
  Top 0.178: TMP48.2 32.47,22.86 37.58,17.75 46.32,17.75 46.71,18.15 49.88,18.15 50.47,17.55 50.47,14.18 49.88,13.59 47.3,13.59 46.86,14.04 43.08,14.04 43.03,14 43.03,12.89 44.84,11.09 57.26,11.09 57.75,11.58 57.75,16.52 57.13,17.14 JP6.1 | v41.07,43.9 R7.1
  Bottom 0.178: v41.07,43.9 41.61,43.9 53.01,32.49 53.27,32.49 54.35,31.41 54.35,18.68 53.81,18.15 JP6.1
N$44  (2 unrouted)
  Top 0.178: 34.7,15.74 34.7,19.54 32.65,21.58 27.32,21.58 TMP48.1 | 34.7,15.74 48.59,15.74 48.73,15.61 JP5.1 | 34.7,15.74 R6.1
N$45  (via drill 0.61 pad 1.02)  (1 unrouted)
  Top 0.178: v18.45,21.03 18.45,21.35 19.31,22.21 32.57,22.21 37.64,17.14 JP5.2 | v49.6,22.7 49.6,22.92 49.22,23.3 IC3.1
  Bottom 0.178: v49.6,22.7 48.73,21.82 48.73,18.15 JP5.2 | JP12.2 9.81,29.84 9.81,29.67 v18.45,21.03
N$46  (via drill 0.61 pad 1.02)  (1 unrouted)
  Top 0.178: IC3.44 49.62,21.5 v49.64,21.47 | v43.85,13.21 53.43,13.21 53.81,13.59 JP6.2
  Bottom 0.178: v49.64,21.47 49.64,18.6 52.64,15.61 53.81,15.61 JP6.2 | v43.85,13.21 43.85,10.29 40.8,7.24 23.69,7.24 20.03,10.9 20.03,22.24 9.89,32.38 JP12.3
N$47  (via drill 0.61 pad 1.02)  (1 unrouted)
  Top 0.178: v35.1,31.3 35.54,31.3 IC3.23
  Bottom 0.178: v35.1,31.3 35.1,12.14 32.22,9.26 JP7.8
N$48  (via drill 0.61 pad 1.02)  (1 unrouted)
  Top 0.178: v38.05,30.5 37.62,30.5 IC3.24
  Bottom 0.178: v38.05,30.5 36.91,29.36 36.91,11.41 34.76,9.26 JP7.10
N$49  (via drill 0.61 pad 1.02)  (1 unrouted)
  Top 0.178: v38.05,28.97 37.62,29.4 37.62,29.7 IC3.25
  Bottom 0.178: v38.05,28.97 37.3,28.22 37.3,9.26 JP7.12
N$50  (via drill 0.61 pad 1.02)  (1 unrouted)
  Top 0.178: v24.3,33.99 25.09,34.78 39.34,34.78 39.98,34.14 IC3.20
  Bottom 0.178: JP7.2 24.6,33.7 v24.3,33.99
N$51  (via drill 0.61 pad 1.02)  (1 unrouted)
  Top 0.178: v39.84,24.22 38.31,24.22 37.62,24.9 IC3.31
  Bottom 0.178: JP7.14 v39.84,24.22
N$52  (via drill 0.61 pad 1.02)  (1 unrouted)
  Top 0.178: v73.14,30.97 73.47,30.97 74.26,30.17 IC4.19 | v58.08,34.42 64.35,34.42 67.78,37.85 v69.87,37.85
  Bottom 0.178: v58.08,34.42 55.17,37.33 55.17,46.21 56.42,47.46 56.42,56.83 55.13,58.12 55.13,65.06 59.93,69.86 59.93,73.03 59.35,73.61 55.67,73.61 54.82,72.76 54.82,71.75 JP8.1 | v69.87,37.85 73.14,34.58 v73.14,30.97
N$53  (via drill 0.61 pad 1.02)  (1 unrouted)
  Top 0.178: v77.86,29.84 77.16,30.54 77.16,30.97 IC4.20
  Bottom 0.178: v77.86,29.84 77.86,29.47 72.59,24.2 72.44,24.2 69.14,20.9 69.14,20.36 53.09,4.31 42.24,4.31 40.85,5.71 JP7.13
N$54  (via drill 0.61 pad 1.02)  (1 unrouted)
  Top 0.178: JP7.11 38.31,5.71 39.31,6.72 41.86,6.72 v42.32,6.25 | IC4.21 75.08,31.77 74.83,32.02 v71.68,32.02
  Bottom 0.178: v42.32,6.25 43.88,4.7 52.93,4.7 68.75,20.52 68.75,21.06 71.45,23.76 71.45,31.79 v71.68,32.02
N$55  (via drill 0.61 pad 1.02)  (1 unrouted)
  Top 0.178: v78.28,31.07 78.28,31.45 77.16,32.57 IC4.22
  Bottom 0.178: v78.28,31.07 78.79,30.55 78.79,29.29 73.32,23.82 72.6,23.82 69.52,20.74 69.52,20.2 53.25,3.93 37.55,3.93 35.77,5.71 JP7.9
N$56  (via drill 0.61 pad 1.02)  (1 unrouted)
  Top 0.178: IC4.23 74.73,33.96 77.21,33.96 v77.36,34.12
  Bottom 0.178: v77.36,34.12 79.47,32.01 79.47,29.43 73.47,23.44 72.75,23.44 69.9,20.59 69.9,20.05 53.4,3.55 35.39,3.55 33.23,5.71 JP7.7
N$57  (via drill 0.61 pad 1.02)  (1 unrouted)
  Top 0.178: v76.42,34.91 75.92,35.41 73.52,35.41 IC4.24
  Bottom 0.178: v76.42,34.91 76.5,35 77.61,35 79.85,32.76 79.85,27.59 75.32,23.05 72.91,23.05 70.29,20.43 70.29,19.88 53.56,3.16 33.24,3.16 30.69,5.71 JP7.5
N$58  (via drill 0.61 pad 1.02)  (1 unrouted)
  Top 0.178: v67.92,35.85 IC4.31
  Bottom 0.178: v67.92,35.85 68.74,36.66 69.57,36.66 70.69,35.54 70.69,25.69 71.03,25.35 71.03,24.34 68.37,21.68 68.37,20.68 54.41,6.72 42.99,6.72 42.66,7.05 41.99,7.05 41.66,6.72 29.15,6.72 28.15,5.71 JP7.3
N$59  (via drill 0.61 pad 1.02)  (2 unrouted)
  Top 0.178: v16.16,35.73 16.38,35.94 37.18,35.94 R8.2 39.79,37.46 41.58,35.67 IC3.18
  Bottom 0.178: v16.16,35.73 9.01,35.73 6.37,33.09 6.37,29.02 7.08,28.31 8.09,28.31 JP12.1
N$60  (via drill 0.61 pad 1.02)  (2 unrouted)
  Top 0.178: v29.83,53.38 31.93,53.38 | 31.93,53.38 33.7,55.15 41.06,55.15 44.97,59.05 R9.1 | 31.93,53.38 31.93,51.08 32.05,50.96 IC1.18
  Bottom 0.178: v29.83,53.38 26.79,56.41 24.07,56.41 23.16,55.5 15.71,55.5 JP9.1
N$61  (2 unrouted)
  Top 0.178: 57.62,60.44 62.1,60.44 62.93,61.27 69.06,61.27 69.52,60.81 IC2.18 | 57.62,60.44 55.78,60.44 53.01,57.67 53.01,55.59 53.06,55.54 56.1,55.54 57.75,53.89 R10.2 | 57.62,60.44 57.62,60.06 JP10.1
N$62  (via drill 0.61 pad 1.02)  (1 unrouted)
  Top 0.178: v12.76,54.04 21.4,45.41 24.41,45.41 IC1.1
  Bottom 0.178: v12.76,54.04 12.76,56.1 14.7,58.04 15.71,58.04 JP9.2
N$63  (1 unrouted)
  Top 0.178: IC1.44 21.2,46.16 13.56,53.8 13.56,54.47 11.37,56.66 5.21,56.66 4.12,57.75 4.12,57.82 5.61,59.31 6.52,59.31 7.07,59.86 7.07,61.54 7.12,61.59 JP9.3
N$64  (via drill 0.61 pad 1.02)  (1 unrouted)
  Top 0.178: v77.01,49.01 77.16,49.16 77.16,49.97 IC2.1 | v76.17,66.38 72.83,66.38 71.65,67.56 61.65,67.56 v60.85,66.76
  Bottom 0.178: v77.01,49.01 77.01,65.54 v76.17,66.38 | v60.85,66.76 60.85,64.82 58.63,62.6 57.62,62.6 JP10.2
N$65  (via drill 0.61 pad 1.02)  (1 unrouted)
  Top 0.178: v74.62,67.56 74.24,67.94 60.43,67.94 57.62,65.14 JP10.3 | v75.28,48.17 IC2.44
  Bottom 0.178: v74.62,67.56 75.28,66.9 v75.28,48.17
N$66  (via drill 0.61 pad 1.02)  (2 unrouted)
  Top 0.178: IC4.18 77.16,29.37 77.16,24.32 v77.53,23.95 | JP11.1 R11.2
  Bottom 0.178: v77.53,23.95 76.93,23.36 76.93,6.98 JP11.1
N$67  (1 unrouted)
  Top 0.178: IC4.1 66.32,21.59 68.63,19.29 84.53,19.29 90.37,13.45 93.61,13.45 94.19,12.87 94.19,9.4 89.53,4.74 82.72,4.74 81.49,5.97 81.49,6.98 JP11.2
N$68  (1 unrouted)
  Top 0.178: JP11.3 83.02,11.89 76.92,17.99 68.3,17.99 64.82,21.46 64.82,23.78 65.56,24.52 65.56,24.57 IC4.44
N$69  (via drill 0.61 pad 1.02)  (1 unrouted)
  Top 0.178: IC3.38 41.58,22.54 35.88,22.54 34.97,23.45 30.11,23.45 v29.83,23.74
  Bottom 0.178: JP13.1 19.98,40 28.95,31.03 28.95,27.3 29.83,26.43 v29.83,23.74
N$70  (via drill 0.61 pad 1.02)  (1 unrouted)
  Top 0.178: v40.49,27.7 40.49,27.09 42.2,25.38 42.2,25.21 43.98,23.43 IC3.41
  Bottom 0.178: JP13.2 4.17,41.38 4.17,43.14 4.58,43.55 26.14,43.55 40.49,29.2 v40.49,27.7
N$71  (via drill 0.61 pad 1.02)  (1 unrouted)
  Top 0.178: v29.76,28.1 IC3.27
  Bottom 0.178: JP13.3 18.38,42.54 29.76,31.16 v29.76,28.1
N$72  (via drill 0.61 pad 1.02)  (1 unrouted)
  Top 0.178: IC3.26 30.54,28.9 30.09,29.34 v23.01,29.34
  Bottom 0.178: v23.01,29.34 23.01,32.29 16.93,38.37 7.72,38.37 6.56,39.54 6.56,40.53 5.55,41.53 JP13.4
N$73  (via drill 0.61 pad 1.02)  (1 unrouted)
  Top 0.178: v42.39,28 42.39,25.73 42.59,25.54 42.59,25.37 43.85,24.1 IC3.2 | JP13.5 9.1,45.08 12.23,48.22 v13.11,48.22
  Bottom 0.178: v42.39,28 42.39,28.38 22.56,48.22 v13.11,48.22
N$74  (via drill 0.61 pad 1.02)  (1 unrouted)
  Top 0.178: v38.99,35.65 38.84,35.5 24.65,35.5 v21.65,32.5 | IC3.43 45.58,22.8 v45.25,23.13
  Bottom 0.178: v45.25,23.13 45.15,23.23 45.15,28.86 38.99,35.02 v38.99,35.65 | v21.65,32.5 16.72,37.43 6.7,37.43 3.78,40.35 3.78,43.31 4.54,44.07 5.55,44.07 JP13.6
N$75  (via drill 0.61 pad 1.02)  (1 unrouted)
  Top 0.178: v49.64,25.44 49.38,25.7 49.22,25.7 IC3.4 | JP13.7 9.1,47.62 9.1,48.22 v10.54,49.66
  Bottom 0.178: v10.54,49.66 18.94,49.66 24.54,55.26 25.72,55.26 31.34,49.64 32.76,49.64 41.18,41.22 43.74,41.22 52.85,32.11 53.11,32.11 53.96,31.25 53.96,29.76 v49.64,25.44
N$76  (via drill 0.61 pad 1.02)  (1 unrouted)
  Top 0.178: IC3.3 44.19,24.9 v43.39,25.7
  Bottom 0.178: v43.39,25.7 41.59,27.5 41.59,28.65 23.62,46.61 7.56,46.61 6.56,47.62 JP13.8
N$77  (via drill 0.61 pad 1.02)  (1 unrouted)
  Top 0.178: v43.2,27.07 46.57,27.07 47.13,26.5 IC3.5
  Bottom 0.178: v43.2,27.07 43.2,28.98 23.02,49.15 11.17,49.15 10.87,48.85 7.86,48.85 6.56,50.16 JP13.10
N$78  (1 unrouted)
  Top 0.178: JP13.15 10.79,57.78 21.57,47 21.57,46.96 IC1.43
N$79  (1 unrouted)
  Top 0.178: IC1.2 25.21,43.32 22.33,43.32 9.37,56.27 7.59,56.27 6.56,55.24 JP13.14
N$80  (1 unrouted)
  Top 0.178: JP13.13 9.86,55.24 22.17,42.93 25.63,42.93 26.01,43.32 IC1.3
N$81  (1 unrouted)
  Top 0.178: IC1.4 26.81,43.32 26.04,42.55 22.01,42.55 10.85,53.71 7.56,53.71 6.56,52.7 JP13.12
N$82  (1 unrouted)
  Top 0.178: IC1.5 27.61,43.32 26.46,42.17 20.3,42.17 9.77,52.7 9.1,52.7 JP13.11
N$83  (1 unrouted)
  Top 0.178: JP13.16 6.56,57.78 7.94,59.17 10.46,59.17 21.06,48.56 IC1.41
N$84  (via drill 0.61 pad 1.02)  (1 unrouted)
  Top 0.178: v41.86,72.24 39.49,69.87 30.42,69.87 25.01,64.46 8.68,64.46 5.55,61.33 JP13.18 | v53.84,56.37 IC2.25
  Bottom 0.178: v41.86,72.24 41.86,68.35 v53.84,56.37
N$85  (via drill 0.61 pad 1.02)  (1 unrouted)
  Top 0.178: v37.5,48.79 51.08,48.79 53.14,46.73 54.71,46.73 55.17,47.19 55.17,47.42 55.33,47.58 v61.3,47.58 | IC2.26 61.7,55.57 v61.68,55.55
  Bottom 0.178: v61.68,55.55 61.3,55.16 v61.3,47.58 | v37.5,48.79 25.97,60.32 9.1,60.32 JP13.17
N$86  (via drill 0.61 pad 1.02)  (1 unrouted)
  Top 0.178: IC2.27 63.48,54.77 61.75,53.04 v60.49,53.04
  Bottom 0.178: v60.49,53.04 60.49,46.91 60.64,46.77 62.06,46.77 62.11,46.82 62.11,48.59 61.68,49.01 61.68,53.41 61.96,53.68 63.33,53.68 64.41,52.6 64.41,48.26 65.92,46.75 65.92,46.74 74.52,38.14 86.42,38.14 92.17,32.38 JP14.2
N$87  (1 unrouted)
  Top 0.178: IC2.41 71.92,47.13 86.67,32.38 JP14.1
N$88  (1 unrouted)
  Top 0.178: JP14.4 93.18,30.85 92.17,31.85 92.17,33.11 77.34,47.94 76.69,47.94 75,49.63 73.24,49.63 72.38,50.49 70.62,50.49 69.52,49.39 IC2.38
N$89  (1 unrouted)
  Top 0.178: JP14.3 90.64,30.85 91.65,31.85 91.65,33.06 77.45,47.26 76.3,47.26 76.17,47.13 73.52,47.13 IC2.43
N$90  (1 unrouted)
  Top 0.178: IC2.2 77.16,50.77 77.99,49.94 77.99,48.95 90.62,36.31 91.17,36.31 94.59,32.89 94.59,29.71 93.18,28.31 JP14.6
N$91  (via drill 0.61 pad 1.02)  (1 unrouted)
  Top 0.178: IC2.3 77.9,51.57 78.56,50.91 78.56,48.91 90.64,36.83 92.54,36.83 v93.04,36.34
  Bottom 0.178: JP14.5 90.64,28.31 91.65,29.31 91.65,30.31 92.7,31.37 93.62,31.37 94.59,32.33 94.59,34.79 v93.04,36.34
N$92  (via drill 0.61 pad 1.02)  (1 unrouted)
  Top 0.178: IC2.5 81.75,53.17 v83.97,50.95
  Bottom 0.178: v83.97,50.95 83.97,47.98 89.27,42.68 93.8,42.68 95.1,41.39 95.1,32.11 93.97,30.99 92.86,30.99 92.03,30.16 92.03,27.15 90.64,25.77 JP14.7
N$93  (1 unrouted)
  Top 0.178: IC2.4 81.3,52.37 88.43,45.23 94.16,45.23 95.36,44.04 95.36,27.95 93.18,25.77 JP14.8
N$94  (1 unrouted)
  Top 0.178: IC4.25 72.72,35.41 73.1,35.8 77.37,35.8 87.4,25.77 91.06,25.77 92.17,24.65 92.17,24.23 93.18,23.23 JP14.10
N$95  (via drill 0.61 pad 1.02)  (1 unrouted)
  Top 0.178: IC4.26 71.92,36.21 72.64,36.93 v77.3,36.93
  Bottom 0.178: v77.3,36.93 89.25,24.98 89.25,22.6 89.63,22.22 JP14.9
N$96  (1 unrouted)
  Top 0.178: JP14.12 92.17,19.68 91.17,20.69 89.97,20.69 78.78,31.87 78.47,31.87 77.02,33.33 71.12,33.33 IC4.27
N$97  (1 unrouted)
  Top 0.178: JP14.11 89.57,19.68 85.85,23.4 78.33,23.4 78.02,23.08 76.02,23.08 71.09,28.01 69.87,28.01 69.48,28.39 68.51,28.39 67.78,27.66 66.26,27.66 65.56,26.97 IC4.41
N$98  (1 unrouted)
  Top 0.178: IC4.43 65.56,25.37 65.59,25.35 66.36,25.35 68.16,27.15 68.16,27.51 68.66,28.01 69.33,28.01 69.71,27.63 70.94,27.63 75.88,22.69 78.16,22.69 78.49,23.01 85.69,23.01 90.16,18.53 91.79,18.53 92.17,18.15 92.17,17.14 JP14.14
N$99  (1 unrouted)
  Top 0.178: JP14.13 89.63,17.14 89.21,17.14 86.68,19.67 69.18,19.67 67.12,21.73 IC4.2
N$100  (1 unrouted)
  Top 0.178: IC4.3 67.92,23.81 65.94,23.81 65.59,23.46 65.59,21.77 68.46,18.9 84.17,18.9 90,13.07 91.17,13.07 92.17,12.06 JP14.18
N$101  (1 unrouted)
  Top 0.178: JP14.17 89.63,12.06 83.17,18.52 68.31,18.52 65.21,21.62 65.21,23.62 65.79,24.2 68.24,24.2 68.62,23.81 68.72,23.81 IC4.4
N$102  (1 unrouted)
  Top 0.178: IC4.5 69.52,21.73 71.19,20.05 86.84,20.05 88.74,18.15 91.6,18.15 91.65,18.1 91.65,16.61 90.64,15.61 JP14.15
N$103  (via drill 0.61 pad 1.02)  (1 unrouted)
  Top 0.178: v56.33,29.77 60.82,29.77 61.29,29.31 63.41,29.31 63.48,29.37 IC4.38
  Bottom 0.178: v56.33,29.77 55.71,29.77 54.73,30.75 54.73,31.57 53.42,32.88 53.17,32.88 44.24,41.81 44.24,41.89 41.35,44.78 40.25,44.78 39.24,43.77 39.18,43.77 32.92,50.03 31.5,50.03 25.88,55.65 24.38,55.65 19.2,50.46 9.4,50.46 9.1,50.16 JP13.9
N$104  (via drill 0.61 pad 1.02)  (1 unrouted)
  Top 0.178: v27.78,59.68 26.01,57.91 IC1.31
  Bottom 0.178: v27.78,59.68 39.7,71.6 39.7,75.91 39.97,76.19 43.24,76.19 44.58,74.85 59.32,74.85 62.98,78.51 78.72,78.51 93.33,63.89 94.18,63.89 96.21,61.86 96.21,18.64 93.18,15.61 JP14.16
VCC  (via drill 0.61 pad 1.02)  (24 unrouted)
  Top 0.498: 71.03,47.22 71.12,47.3 IC2.40 | 43.26,21.4 43.26,21.43 IC3.40
  Top 0.533: 54.17,29.97 54.17,31.89 54.85,32.58 55.87,32.58 56.45,33.15 56.45,34.17 57.68,35.4 58.37,35.4 61.84,38.87 70.32,38.87 | IC3.7 52.3,28.1 54.17,29.97 | 54.17,29.97 54.72,29.97 57.07,27.61 63.03,27.61 63.09,27.56 | 39.47,27.3 41.64,25.13 41.64,24.98 43.26,23.36 43.26,21.4 | 70.58,46.77 70.51,46.84 68.91,46.84 68.61,46.53 65.31,46.53 64.76,47.08 64.16,47.08 62.07,49.17 61.89,49.17 61.52,49.55 54.95,49.55 | 70.32,38.87 70.92,39.47 70.92,45.29 71.08,45.45 71.08,46.26 70.58,46.77 | 70.58,46.77 71.03,47.22 | 39.47,27.3 39.47,28.16 42.38,31.06 IC3.17 42.38,36.9 39.95,39.33 | R2.E 90.78,61.57 89.43,60.22 83.72,60.22 | 83.72,60.22 74.6,69.34 74.22,69.34 | IC2.7 78.28,54.77 83.72,60.22 | 54.91,62.86 60.92,62.86 61.57,62.22 69.36,62.22 70.32,61.25 IC2.17 70.32,58.55 65.74,53.97 IC2.28 | 28.48,50.39 28.71,50.16 IC1.17 35.76,50.16 36.14,50.54 46.23,50.54 50.62,54.93 | IC1.28 28.41,50.46 28.48,50.39 | 28.48,50.39 27.2,49.12 | 27.2,49.12 26.96,49.36 IC1.40 | 27.2,49.12 29.21,47.11 IC1.7 29.21,43.14 32.62,39.73 37.17,39.73 | 50.62,54.93 52.84,52.7 53.68,52.7 | 50.62,54.93 50.62,58.57 | 54.95,49.55 54.95,49.8 54.63,50.12 54.63,51.01 54.95,51.33 R10.1 | 58.13,69.34 54.91,66.12 54.91,62.86 | 58.13,69.34 74.22,69.34 | 58.13,69.34 57.53,69.94 57.53,71.75 JP8.2 | 74.22,69.34 74.22,73.02 JP15.11 JP15.13 | IC4.17 74.92,28.57 73.5,29.99 72.33,29.99 70.32,32 70.32,33.15 IC4.28 | 43.27,6.89 43.3,6.86 43.3,5.84 41.44,3.98 9.11,3.98 7.84,5.25 7.84,6.98 J1.1 | 70.32,36.45 70.85,36.98 70.85,38.34 70.32,38.87 | 63.09,27.56 63.2,27.44 63.2,22.29 70.13,15.36 | 63.09,27.56 63.3,27.77 IC4.40 | v71.85,20.86 71.81,20.86 71.12,21.55 IC4.7
  Top 0.533: 43.27,6.89 38.09,12.07 34.76,12.07 31.57,15.25 31.57,18.54 | 43.27,6.89 51.27,6.89 JP4.2 62.7,5.71 | 39.47,27.3 IC3.28 | 70.13,15.36 77.94,15.36 | 70.13,15.36 70.13,13.14 62.7,5.71 | 50.62,58.57 50.13,59.05 R9.2 | 50.62,58.57 54.91,62.86 | R10.1 53.68,52.7 | 70.32,36.45 IC4.28 | 70.32,36.45 IC4.28 | 39.95,39.33 41.24,40.61 41.24,42.54 R7.2 | 37.17,39.73 37.57,39.33 39.95,39.33 | Q1.C 53.98,48.59 54,48.59 54.95,49.55 | 31.57,18.54 R6.2 | 31.57,18.54 25.35,18.54 22.3,21.58 TMP48.8 | 62.7,5.71 QG1.4 | 77.94,15.36 R11.1 77.94,15.36 | 37.17,39.73 37.17,37.46 R8.1 | R10.1 53.68,52.7
  Bottom 0.533: QG1.4 71.85,12.32 v71.85,20.86 | JP3.7 93.18,47.53 92.69,47.53 91.91,48.31 91.91,53.16 90.31,54.75 90.31,57.62 91.91,59.21 R2.E